# Altium schematic sheet Flight_Controller3.SchDoc: Sensorless BLDC Controller
size A3; PageSetup: Record=PageOptions|CenterHorizontal=True|CenterVertical=True|PrintScale=0.34|XCorrection=1.00|YCorrection=1.00|PrintKind=1|BorderSize=5000000|LeftOffset=0|BottomOffset=0|Orientation=2|PaperLength=1000|PaperWidth=1000|Scale=100|PaperSource=7|PrintQuality=-3|MediaType=1|DitherType=10|PrintScaleMode=1|PaperKind=A3|PaperIndex=8
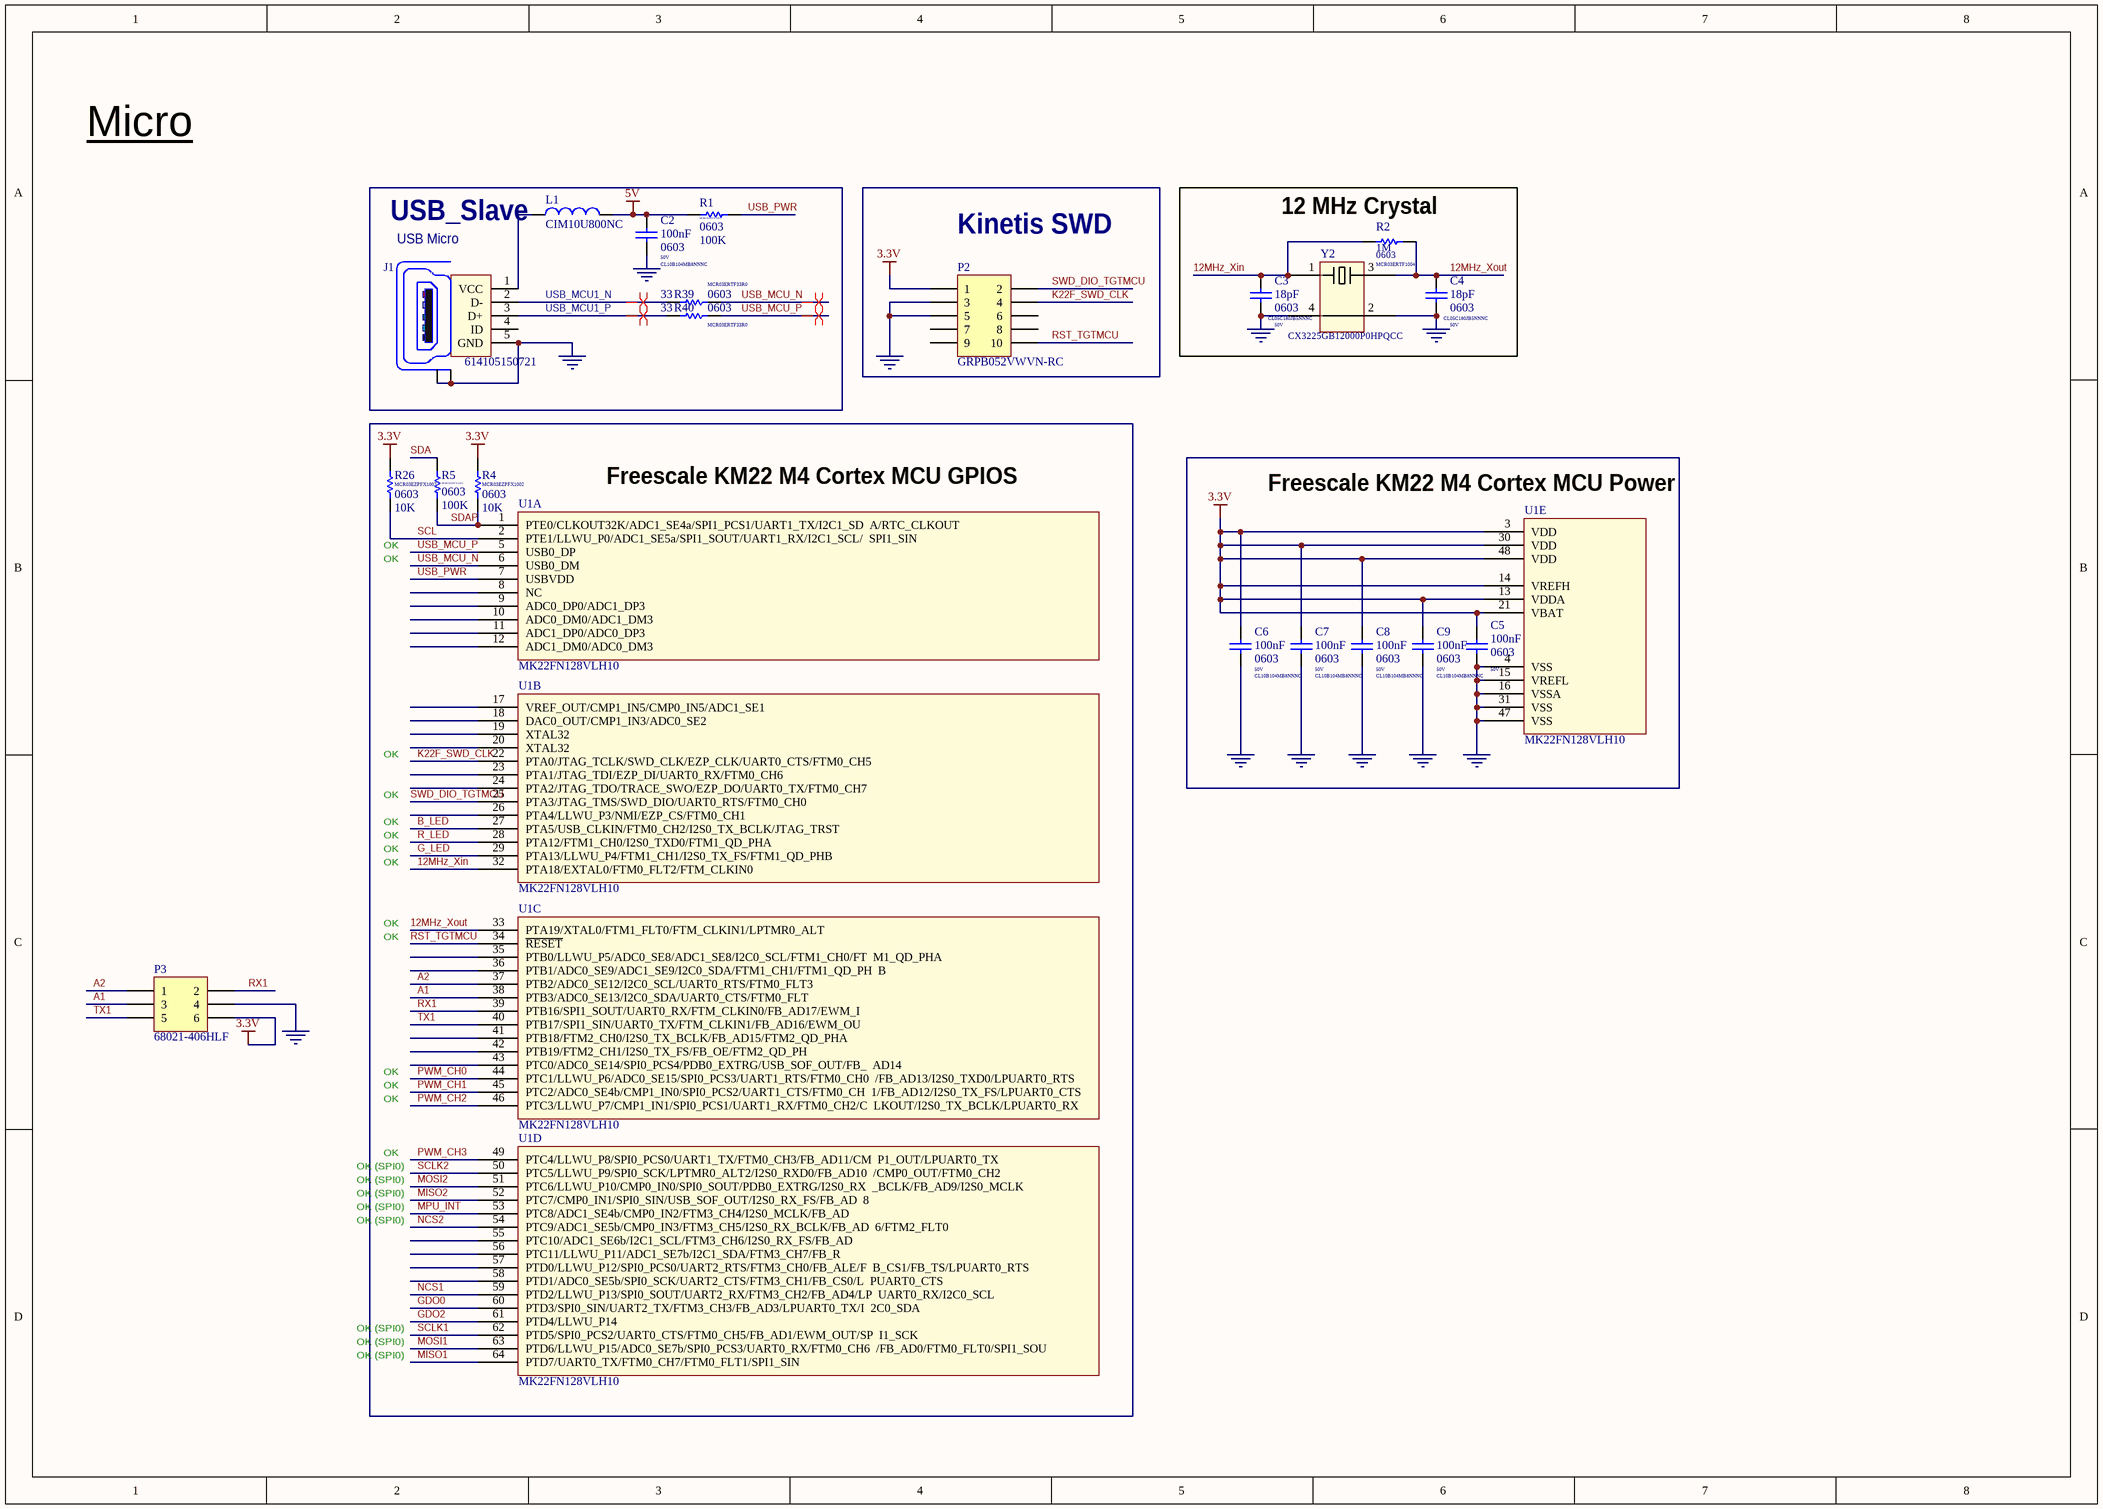
[diagram p0: Flight_Controller3.SchDoc]

## Parts
C2  CL10B104MB8NNNC  value 100nF  PackageReference: 0603  Voltage: 50V  [1608[0603]C]
C3  CL05C180JB5NNNC  value 18pF  PackageReference: 0603  Voltage: 50V  [1608[0603]C]
C4  CL05C180JB5NNNC  value 18pF  PackageReference: 0603  Voltage: 50V  [1608[0603]C]
C5  value 100nF  PackageReference: 0603  Voltage: 50V  [1608[0603]C]  (hidden comment: CL10B104MB8NNNC)
C6  CL10B104MB8NNNC  value 100nF  PackageReference: 0603  Voltage: 50V  [1608[0603]C]
C7  CL10B104MB8NNNC  value 100nF  PackageReference: 0603  Voltage: 50V  [1608[0603]C]
C8  CL10B104MB8NNNC  value 100nF  PackageReference: 0603  Voltage: 50V  [1608[0603]C]
C9  CL10B104MB8NNNC  value 100nF  PackageReference: 0603  Voltage: 50V  [1608[0603]C]
J1  614105150721  [USB_Micro_Vertical]
L1  CIM10U800NC  [1608[0603]L]
P2  GRPB052VWVN-RC  [MHDR2X5]
P3  68021-406HLF  [HDR2X3_3D2]
R1  MCR03EZPFX1003  value 100K  PackageReference: 0603  [1608[0603]R]
R2  MCR03ERTF1004  value 1M  PackageReference: 0603  [1608[0603]R]
R4  MCR03EZPFX1002  value 10K  PackageReference: 0603  [1608[0603]R]
R5  MCR03EZPFX1003  value 100K  PackageReference: 0603  [1608[0603]R]
R26  MCR03EZPFX1002  value 10K  PackageReference: 0603  [1608[0603]R]
R39  MCR03ERTF33R0  value 33  PackageReference: 0603  [1608[0603]R]
R40  MCR03ERTF33R0  value 33  PackageReference: 0603  [1608[0603]R]
U1  MK22FN128VLH10  [LQFP64_10mm_0.5mm]  (parts A,B,C,D,E of 5)
Y2  CX3225GB12000P0HPQCC  [3225_Crystal]

## Blocks framed on the sheet
USB_Slave: C2 J1 L1 R1 R39 R40
Kinetis SWD: P2
12 MHz Crystal: C3 C4 R2 Y2
Freescale KM22 M4 Cortex MCU GPIOS: R4 R5 R26 U1
Freescale KM22 M4 Cortex MCU Power: C5-C9 U1

## Nets
3.3V: C5.2 C6.2 C7.2 C8.2 C9.2 P2.1 P3.6 R4.2 R26.2 U1.3(VDD) U1.13(VDDA) U1.14(VREFH) U1.21(VBAT) U1.30(VDD) U1.48(VDD)
5V: C2.2 L1.1 R1.1
GND: C2.1 C3.1 C4.1 C5.1 C6.1 C7.1 C8.1 C9.1 J1.5(GND) J1.Z1(Shield) J1.Z2(Shield) P2.3 P2.5 P3.4 U1.4(VSS) U1.15(VREFL) U1.16(VSSA) U1.31(VSS) U1.47(VSS) Y2.2(GND) Y2.4(GND)
12MHz_Xin: C3.2 R2.2 U1.32(PTA18/EXTAL0/FTM0_FLT2/FTM_CLKIN0) Y2.1(X1)
12MHz_Xout: C4.2 R2.1 U1.33(PTA19/XTAL0/FTM1_FLT0/FTM_CLKIN1/LPTMR0_ALT) Y2.3(X2)
A1: P3.3 U1.38(PTB3/ADC0_SE13/I2C0_SDA/UART0_CTS/FTM0_FLT)
A2: P3.1 U1.37(PTB2/ADC0_SE12/I2C0_SCL/UART0_RTS/FTM0_FLT3)
B_LED: U1.27(PTA5/USB_CLKIN/FTM0_CH2/I2S0_TX_BCLK/JTAG_TRST)
G_LED: U1.29(PTA13/LLWU_P4/FTM1_CH1/I2S0_TX_FS/FTM1_QD_PHB)
GDO0: U1.60(PTD3/SPI0_SIN/UART2_TX/FTM3_CH3/FB_AD3/LPUART0_TX/I__2C0_SDA)
GDO2: U1.61(PTD4/LLWU_P14)
K22F_SWD_CLK: P2.4 U1.22(PTA0/JTAG_TCLK/SWD_CLK/EZP_CLK/UART0_CTS/FTM0_CH5)
MISO1: U1.64(PTD7/UART0_TX/FTM0_CH7/FTM0_FLT1/SPI1_SIN)
MISO2: U1.52(PTC7/CMP0_IN1/SPI0_SIN/USB_SOF_OUT/I2S0_RX_FS/FB_AD__8)
MOSI1: U1.63(PTD6/LLWU_P15/ADC0_SE7b/SPI0_PCS3/UART0_RX/FTM0_CH6__/FB_AD0/FTM0_FLT0/SPI1_SOU)
MOSI2: U1.51(PTC6/LLWU_P10/CMP0_IN0/SPI0_SOUT/PDB0_EXTRG/I2S0_RX___BCLK/FB_AD9/I2S0_MCLK)
MPU_INT: U1.53(PTC8/ADC1_SE4b/CMP0_IN2/FTM3_CH4/I2S0_MCLK/FB_AD)
NCS1: U1.59(PTD2/LLWU_P13/SPI0_SOUT/UART2_RX/FTM3_CH2/FB_AD4/LP__UART0_RX/I2C0_SCL)
NCS2: U1.54(PTC9/ADC1_SE5b/CMP0_IN3/FTM3_CH5/I2S0_RX_BCLK/FB_AD__6/FTM2_FLT0)
PWM_CH0: U1.44(PTC1/LLWU_P6/ADC0_SE15/SPI0_PCS3/UART1_RTS/FTM0_CH0__/FB_AD13/I2S0_TXD0/LPUART0_RTS)
PWM_CH1: U1.45(PTC2/ADC0_SE4b/CMP1_IN0/SPI0_PCS2/UART1_CTS/FTM0_CH__1/FB_AD12/I2S0_TX_FS/LPUART0_CTS)
PWM_CH2: U1.46(PTC3/LLWU_P7/CMP1_IN1/SPI0_PCS1/UART1_RX/FTM0_CH2/C__LKOUT/I2S0_TX_BCLK/LPUART0_RX)
PWM_CH3: U1.49(PTC4/LLWU_P8/SPI0_PCS0/UART1_TX/FTM0_CH3/FB_AD11/CM__P1_OUT/LPUART0_TX)
R_LED: U1.28(PTA12/FTM1_CH0/I2S0_TXD0/FTM1_QD_PHA)
RST_TGTMCU: P2.10 U1.34(~{RESET})
RX1: P3.2 U1.39(PTB16/SPI1_SOUT/UART0_RX/FTM_CLKIN0/FB_AD17/EWM_I)
SCL: R26.1 U1.2(PTE1/LLWU_P0/ADC1_SE5a/SPI1_SOUT/UART1_RX/I2C1_SCL/__SPI1_SIN)
SCLK1: U1.62(PTD5/SPI0_PCS2/UART0_CTS/FTM0_CH5/FB_AD1/EWM_OUT/SP__I1_SCK)
SCLK2: U1.50(PTC5/LLWU_P9/SPI0_SCK/LPTMR0_ALT2/I2S0_RXD0/FB_AD10__/CMP0_OUT/FTM0_CH2)
SDA: R5.2
SDAP: R4.1 R5.1 U1.1(PTE0/CLKOUT32K/ADC1_SE4a/SPI1_PCS1/UART1_TX/I2C1_SD__A/RTC_CLKOUT)
SWD_DIO_TGTMCU: P2.2 U1.25(PTA3/JTAG_TMS/SWD_DIO/UART0_RTS/FTM0_CH0)
TX1: P3.5 U1.40(PTB17/SPI1_SIN/UART0_TX/FTM_CLKIN1/FB_AD16/EWM_OU)
USB_MCU1_N: J1.2(D-) R39.2
USB_MCU1_P: J1.3(D+) R40.2
USB_MCU_N: R39.1 U1.6(USB0_DM)
USB_MCU_P: R40.1 U1.5(USB0_DP)
USB_PWR: R1.2 U1.7(USBVDD)
NetJ1_1: J1.1(VCC) L1.2

Not connected (* = marked no-connect by the designer): J1 4(ID); P2 6 7 8 9; U1 8(NC) 9(ADC0_DP0/ADC1_DP3) 10(ADC0_DM0/ADC1_DM3) 11(ADC1_DP0/ADC0_DP3) 12(ADC1_DM0/ADC0_DM3) 17(VREF_OUT/CMP1_IN5/CMP0_IN5/ADC1_SE1) 18(DAC0_OUT/CMP1_IN3/ADC0_SE2) 19(XTAL32) 20(XTAL32) 23(PTA1/JTAG_TDI/EZP_DI/UART0_RX/FTM0_CH6) 24(PTA2/JTAG_TDO/TRACE_SWO/EZP_DO/UART0_TX/FTM0_CH7) 26(PTA4/LLWU_P3/NMI/EZP_CS/FTM0_CH1) 35(PTB0/LLWU_P5/ADC0_SE8/ADC1_SE8/I2C0_SCL/FTM1_CH0/FT__M1_QD_PHA) 36(PTB1/ADC0_SE9/ADC1_SE9/I2C0_SDA/FTM1_CH1/FTM1_QD_PH__B) 41(PTB18/FTM2_CH0/I2S0_TX_BCLK/FB_AD15/FTM2_QD_PHA) 42(PTB19/FTM2_CH1/I2S0_TX_FS/FB_OE/FTM2_QD_PH) 43(PTC0/ADC0_SE14/SPI0_PCS4/PDB0_EXTRG/USB_SOF_OUT/FB___AD14) 55(PTC10/ADC1_SE6b/I2C1_SCL/FTM3_CH6/I2S0_RX_FS/FB_AD) 56(PTC11/LLWU_P11/ADC1_SE7b/I2C1_SDA/FTM3_CH7/FB_R) 57(PTD0/LLWU_P12/SPI0_PCS0/UART2_RTS/FTM3_CH0/FB_ALE/F__B_CS1/FB_TS/LPUART0_RTS) 58(PTD1/ADC0_SE5b/SPI0_SCK/UART2_CTS/FTM3_CH1/FB_CS0/L__PUART0_CTS)

## Layout directives
differential pair: USB_MCU1_N, USB_MCU1_P, USB_MCU_N, USB_MCU_P

## Notes on the sheet
- Micro
- (near J1) USB Micro
- OK
- OK (SPI0)

## Library data of the parts
C2 C5-C9 = Cap Semi: Capacitor (Semiconductor SIM Model); PP1: 0.01210; Page: Micro; PackageDescription: Chip Capacitor; Digikey: 311-1361-1-ND; Part_Number: CL10B104MB8NNNC; PP100: 0.01210
C3 C4 = Cap Semi: Capacitor (Semiconductor SIM Model); PP1: 0.00610; Page: Micro; PackageDescription: Chip Capacitor; Digikey: 311-1361-1-ND; PP100: 0.00610
J1 = WR-Communication Connectors 614105150721: WR-COM_USB_Micro Type B_Vertical_THT; Manufacturer: Würth Elektronik eiSos GmbH; ComponentLink1 Description: Manufacturer; ComponentLink2 Description: Datasheet; NoPins: 5; ComponentLink1URL: http://www.we-online.de; ComponentLink2URL: http://katalog.we-online.de/em/datasheet/614105150721.pdf; Created by: Karrer Zheng; Created Date: 10/25/2014; partNo: 614105150721
L1 = Inductor: PP1: 0.1900; PP100: 0.0620; Page: Micro
P2 = Header 5X2: Header, 5-Pin, Dual row; LatestRevisionDate: 17-Jul-2002; LatestRevisionNote: Re-released for DXP Platform.; Publisher: Altium Limited
P3 = Header 3X2: Header, 3-Pin, Dual row; LatestRevisionDate: 17-Jul-2002; LatestRevisionNote: Re-released for DXP Platform.; Publisher: Altium Limited
R1 R5 = Res1: Resistor; Part_Number: MCR03ERTJ104; PP1: 0.00420; Page: Micro; PP100: 0.00420
R2 = Res1: Resistor; PP1: 0.00470; Page: Ethernet; PP100: 0.00470; ClassName: ETH_2; EXT: EXT
R4 R26 = Res1: Resistor; Part_Number: MCR03ERTJ102; PP1: 0.10000; PP100: 0.00780; Page: PowerInput
R39 = Res1: Resistor; PP1: 0.10000; PP100: 0.00620; Page: Micro
R40 = Res1: Resistor; Part_Number: MCR03ERTJ102; PP1: 0.10000; PP100: 0.00620; Page: Micro
U1 = MK22FN128VLH10: MK22FN128VLH10 MCU
Y2 = 12MHz_Crystal: 12MHz Micro Crystal; PP1: 0.64000; PP100: 0.47000; Value: 12MHz; Page: Micro